# EAGLE design 4 Channel Mixer - Modular (EAGLE 9.6.2)
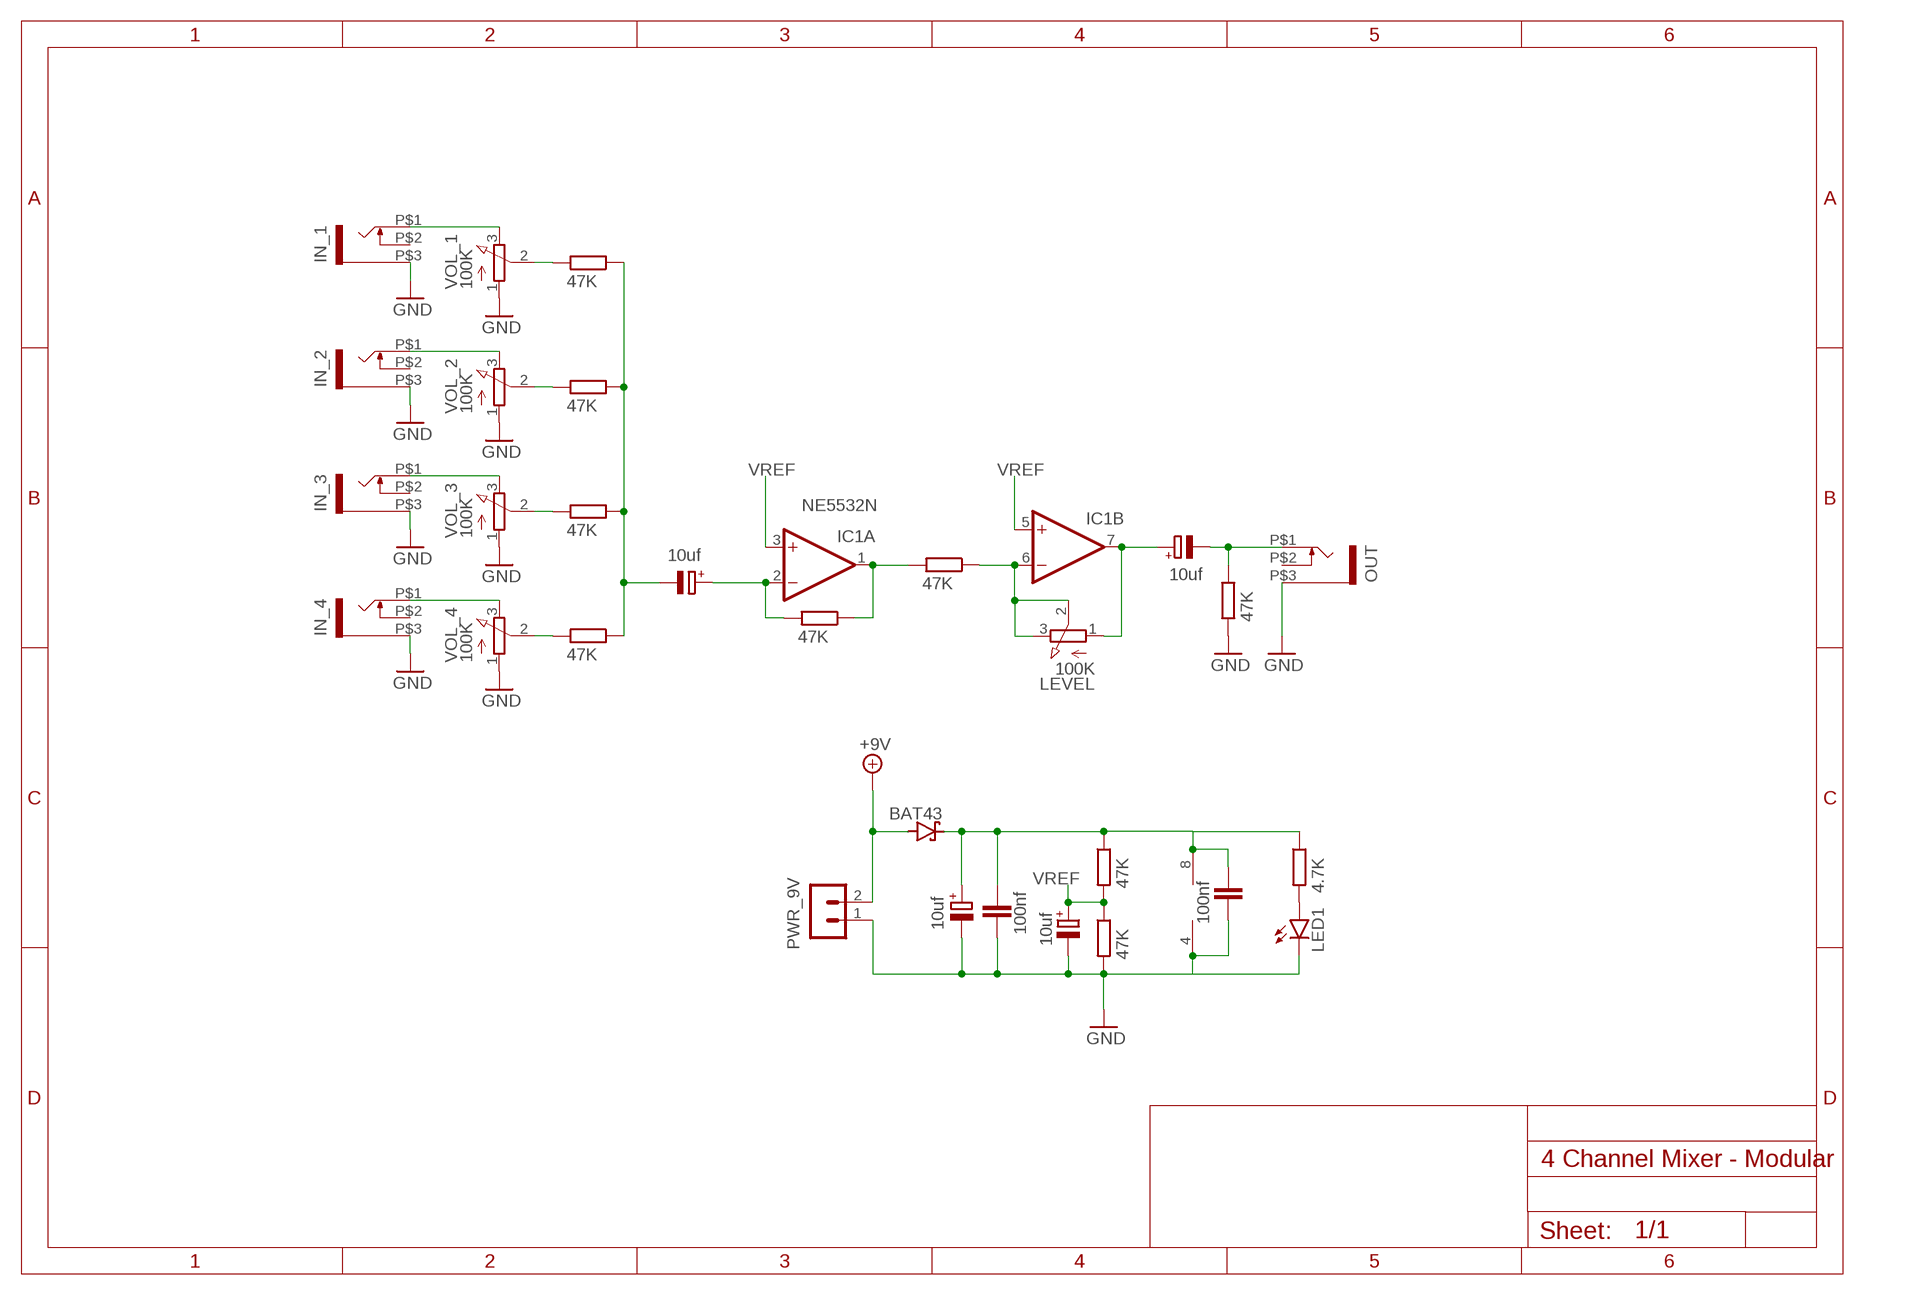
[diagram p0: schematic, sheet 1]

## Parts
C1  10uf  CPOL-EUE2,5-6E  [E2,5-6E]
C2  10uf  CPOL-EUE2,5-6E  [E2,5-6E]
C3  10uf  CPOL-EUE2,5-6E  [E2,5-6E]
C4  10uf  CPOL-EUE2,5-6E  [E2,5-6E]
C5  100nf  C-EU050-024X044  [C050-024X044]
C6  100nf  C-EU050-024X044  [C050-024X044]
D4  BAT43  BAT42  [DO35-10]
IC1  NE5532N  [DIL08]
IN_1  WQP-PJ301M-12_JACK  [WQP-PJ301M-12_JACK]
IN_2  WQP-PJ301M-12_JACK  [WQP-PJ301M-12_JACK]
IN_3  WQP-PJ301M-12_JACK  [WQP-PJ301M-12_JACK]
IN_4  WQP-PJ301M-12_JACK  [WQP-PJ301M-12_JACK]
LED1  LED3MM  [LED3MM]
LEVEL  100K  EVUF2M  [EVUFXM]
OUT  WQP-PJ301M-12_JACK  [WQP-PJ301M-12_JACK]
PWR_9V  B2B-PH-K-S  [B2B-PH-K-S]
R1  47K  R-EU_0204/7  [0204/7]
R2  47K  R-EU_0204/7  [0204/7]
R3  47K  R-EU_0204/7  [0204/7]
R5  47K  R-EU_0204/7  [0204/7]
R7  47K  R-EU_0204/7  [0204/7]
R8  47K  R-EU_0204/7  [0204/7]
R9  47K  R-EU_0204/7  [0204/7]
R10  47K  R-EU_0204/7  [0204/7]
R11  47K  R-EU_0204/7  [0204/7]
R12  4.7K  R-EU_0204/7  [0204/7]
VOL_1  100K  EVUF2M  [EVUFXM]
VOL_2  100K  EVUF2M  [EVUFXM]
VOL_3  100K  EVUF2M  [EVUFXM]
VOL_4  100K  EVUF2M  [EVUFXM]

## Nets
+9V: D4.A PWR_9V.2
GND: C3.- C4.- C5.1 C6.1 IC1.4(P:V-) IN_1.P$3 IN_2.P$3 IN_3.P$3 IN_4.P$3 LED1.K(C) OUT.P$3 PWR_9V.1 R9.2 R11.2 VOL_1.1(A) VOL_2.1(A) VOL_3.1(A) VOL_4.1(A)
N$1: IN_1.P$1 VOL_1.3(E)
N$2: R1.2 VOL_2.2(S)
N$3: IN_2.P$1 VOL_2.3(E)
N$4: R2.2 VOL_3.2(S)
N$5: IN_4.P$1 VOL_4.3(E)
N$6: R3.2 VOL_4.2(S)
N$7: IN_3.P$1 VOL_3.3(E)
N$8: R5.2 VOL_1.2(S)
N$12: C1.- R1.1 R2.1 R3.1 R5.1
N$13: C2.- OUT.P$1 R9.1
N$14: C1.+ IC1.2(A:-IN) R7.2
N$16: IC1.1(A:OUT) R7.1 R8.2
N$17: IC1.6(B:-IN) LEVEL.2(S) LEVEL.3(E) R8.1
N$18: C2.+ IC1.7(B:OUT) LEVEL.1(A)
N$20: LED1.A R12.2
N$21: C4.+ C5.2 C6.2 D4.C IC1.8(P:V+) R10.1 R12.1
VREF: C3.+ IC1.3(A:+IN) IC1.5(B:+IN) R10.2 R11.1
Unconnected: IN_1.P$2 IN_2.P$2 IN_3.P$2 IN_4.P$2 OUT.P$2

## Library data of the parts
C1-C4 = rcl:CPOL-EU: POLARIZED CAPACITOR, European symbol; SPICEPREFIX: C
C5 C6 = rcl:C-EU: CAPACITOR, European symbol; SPICEPREFIX: C
D4 = diode:BAT42: DIODE barrier diode
IC1 = linear4:NE5532: AUDIO AMPLIFIER
IN_1-IN_4 OUT = thonkiconn:WQP-PJ301M-12_JACK
LED1 = led:LED: LED OSRAM: - CHIPLED LG R971, LG N971, LY N971, LG Q971, LY Q971, LO R971, LY R971 LH N974, LH R974 LS Q976, LO Q976, LY Q976 LO Q996 - Hyper CHIPLED LW Q18S LB Q993, LB Q99A, LB R99A - SideLED LS A670, LO A670, LY A670, LG A670, LP A670 LB A673, LV A673, LT A673, LW A673 LH A674 LY A675 LS A676, LA A676, LO A676, LY A676, LW A676 LS A679, LY A679, LG A679 - Hyper Micro SIDELED® LS Y876, LA Y876, LO Y876, LY Y876 LT Y87S - SmartLED LW L88C, LW L88S LB L89C, LB L89S, LG L890 LS L89K, LO L89K, LY L89K LS L896, LA L896, LO L896, LY L896 - TOPLED LS T670, LO T670, LY T670, LG T670, LP T670 LSG T670, LSP T670, LSY T670, LOP T670, LYG T670 LG T671, LOG T671, LSG T671 LB T673, LV T673, LT T673, LW T673 LH T674 LS T676, LA T676, LO T676, LY T676, LB T676, LH T676, LSB T676, LW T676 LB T67C, LV T67C, LT T67C, LS T67K, LO T67K, LY T67K, LW E67C LS E67B, LA E67B, LO E67B, LY E67B, LB E67C, LV E67C, LT E67C LW T67C LS T679, LY T679, LG T679 LS T770, LO T770, LY T770, LG T770, LP T770 LB T773, LV T773, LT T773, LW T773 LH T774 LS E675, LA E675, LY E675, LS T675 LS T776, LA T776, LO T776, LY T776, LB T776 LHGB T686 LT T68C, LB T68C - Hyper Mini TOPLED® LB M676 - Mini TOPLED Santana® LG M470 LS M47K, LO M47K, LY M47K Source: http://www.osram.convergy.de LUXEON: - LUMILED® LXK2-PW12-R00, LXK2-PW12-S00, LXK2-PW14-U00, LXK2-PW14-V00 LXK2-PM12-R00, LXK2-PM12-S00, LXK2-PM14-U00 LXK2-PE12-Q00, LXK2-PE12-R00, LXK2-PE12-S00, LXK2-PE14-T00, LXK2-PE14-U00 LXK2-PB12-K00, LXK2-PB12-L00, LXK2-PB12-M00, LXK2-PB14-N00, LXK2-PB14-P00, LXK2-PB14-Q00 LXK2-PR12-L00, LXK2-PR12-M00, LXK2-PR14-Q00, LXK2-PR14-R00 LXK2-PD12-Q00, LXK2-PD12-R00, LXK2-PD12-S00 LXK2-PH12-R00, LXK2-PH12-S00 LXK2-PL12-P00, LXK2-PL12-Q00, LXK2-PL12-R00 Source: www.luxeon.com KINGBRIGHT: KA-3528ASYC Source: www.kingbright.com
LEVEL VOL_1-VOL_4 = pot:EVU: 9 mm Square Rotary Potentiometers Source: Panasonic
PWR_9V = con-JST PH:B2B-PH: JST PH series header 2.00mm pitch disconnectable crimp style connectors, vertical (side entry type), 2 pins
R1-R3 R5 R7-R12 = rcl:R-EU_: RESISTOR, European symbol; SPICEPREFIX: R

## Board
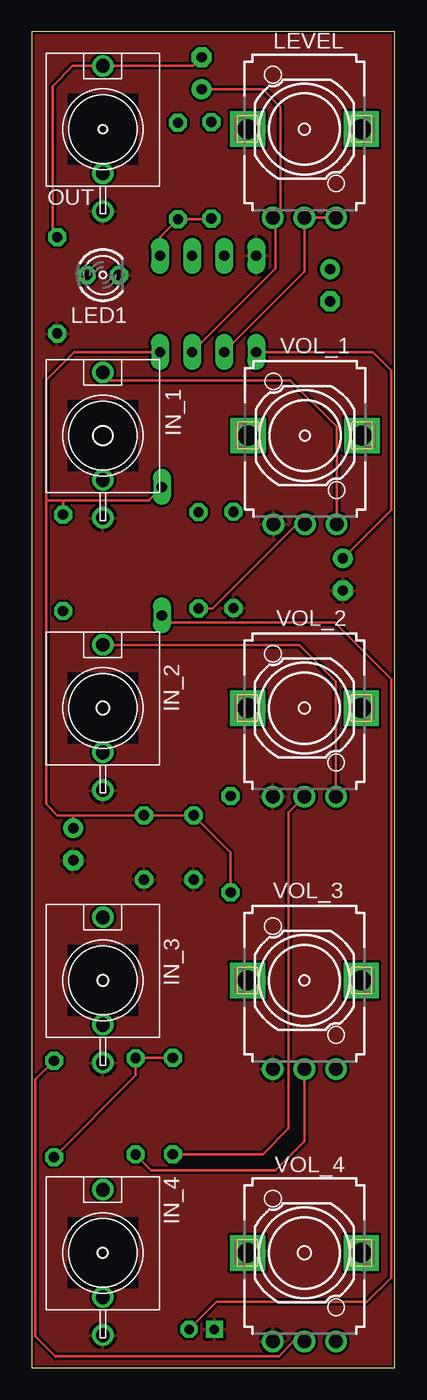
[diagram p1: board, top side]
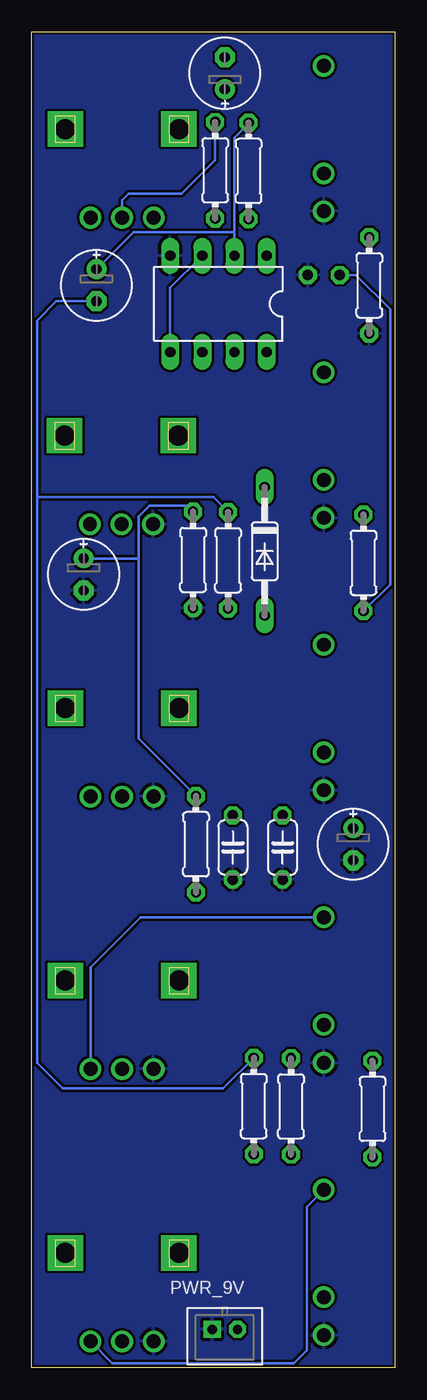
[diagram p2: board, bottom side, seen from below]

Size 28.75 x 105.65 mm. Coordinates in mm from the lower left corner, seen from the top.
Outline: 0,0 28.75,0 28.75,105.65 0,105.65 0,0
Copper layers (1*16): Top 0.035mm / dielectric 1.5mm / Bottom 0.035mm
Design rules "SparkFun": minimum track width 8mil, minimum drill 20mil, track to track 8mil, track to pad 8mil, pad to pad 8mil, via to via 8mil, smd to smd 8mil, copper to edge 8mil, drill to drill 8mil, minimum pad ring 12mil, minimum via ring 10mil, stop-mask expansion 4mil, vias tented up to drill 20mil, thermal gap 10mil

### Footprints (pad centres in the part's own frame; a part is rotated, then mirrored left to right if it is on the bottom)
E2,5-6E = drill 0.813 pad 1.575: + -1.27,0 | drill 0.813 pad 1.575 octagon: - 1.27,0
C050-024X044 = drill 0.813 octagon: 1 -2.54,0; 2 2.54,0
DO35-10 = drill 0.813 long: A 5.08,0; C -5.08,0
DIL08 = drill 0.813 long: 1 -3.81,-3.81; 2 -1.27,-3.81; 3 1.27,-3.81; 4 3.81,-3.81; 5 3.81,3.81; 6 1.27,3.81; 7 -1.27,3.81; 8 -3.81,3.81
WQP-PJ301M-12_JACK = drill 1.1: P$1 0,5; P$2 0,-3.5; P$3 0,-6.5
LED3MM = drill 0.813 octagon: A -1.27,0; K 1.27,0
EVUFXM = drill 1.1 pad 1.676: 1 -2.5,-7; 2 0,-7; 3 2.5,-7 | drill 1.6 pad 2.8 square: M1 4.5,0; M2 -4.5,0
B2B-PH-K-S = drill 0.75 pad 1.3 square: 1 1,0 | drill 0.75 pad 1.3 octagon: 2 -1,0
0204/7 = drill 0.813 octagon: 1 -3.81,0; 2 3.81,0

### Placement (x,y rotation side)
C1  23.62,85.6 270 bottom
C2  13.46,102.36 90 bottom
C3  24.64,62.74 270 bottom
C4  3.3,41.4 270 bottom
C5  8.89,41.15 90 bottom
C6  12.83,41.15 90 bottom
D4  10.31,64.57 270 bottom
IC1  13.97,84.12 180 bottom
IN_1  5.64,73.71 0 top
IN_2  5.64,52.17 0 top
IN_3  5.64,30.63 0 top
IN_4  5.64,9.09 0 top
LED1  5.64,86.41 0 top
LEVEL  21.59,97.94 0 top
OUT  5.64,97.94 0 top
PWR_9V  13.46,3.05 180 bottom
R1  11.18,20.7 270 bottom
R2  8.23,20.68 270 bottom
R3  1.78,20.47 90 bottom
R5  13.21,63.86 270 bottom
R7  11.58,94.64 90 bottom
R8  14.22,94.69 270 bottom
R9  2.03,85.6 270 bottom
R10  15.75,41.4 90 bottom
R11  15.98,63.88 270 bottom
R12  2.49,63.65 270 bottom
VOL_1  21.64,73.71 0 top
VOL_2  21.59,52.17 0 top
VOL_3  21.59,30.63 0 top
VOL_4  21.59,9.09 0 top

### Tracks (layer width: path | path; a pad name or v marks a point on that pad's centre or on a via)
+9V
  Top 0.203: PWR_9V.2 14.62,5.21 26.54,5.21 28.45,7.11 28.45,54.48 24,58.93 10.87,58.93 D4.A
GND
  pour Top: 0,105.66 28.7,105.66 28.7,0 0,0
  pour Bottom: 0,105.66 28.7,105.66 28.7,0 0,0
N$1
  Top 0.203: IN_1.P$1 6.27,78.08 20.48,78.08 24.14,74.41 VOL_1.3
N$2
  Top 0.203: R1.2 18.29,16.89 20.32,18.92 20.32,43.9 VOL_2.2
N$3
  Top 0.203: IN_2.P$1 21.19,57.17 24.09,54.27 VOL_2.3
N$4
  Top 0.203: R2.2 9.47,15.62 19.3,15.62 21.59,17.91 VOL_3.2
N$5
  Bottom 0.203: VOL_4.3 22.38,0.38 8,0.38 6.99,1.4 6.99,12.75 IN_4.P$1
N$6
  Top 0.203: VOL_4.2 20.73,2.09 19.57,0.93 1.95,0.93 1.91,0.89 0.3,2.49 0.3,22.81 R3.2
N$7
  Bottom 0.203: IN_3.P$1 20.12,35.63 24.09,31.66 VOL_3.3
N$8
  Top 0.203: VOL_1.2 20.99,66.71 14.33,60.05 R5.2
N$12
  Top 0.203: R3.1 8.23,23.11 R2.1 8.26,24.51 R1.1
  Bottom 0.203: R1.1 13.59,22.1 26.29,22.1 28.32,24.13 28.32,68.83 | 28.32,68.83 28.32,82.8 26.8,84.33 C1.- | R5.1 14.38,68.83 28.32,68.83
N$13
  Top 0.203: R9.1 1.65,89.79 1.65,101.35 3.25,102.94 OUT.P$1 12.77,102.94 C2.-
N$14
  Bottom 0.203: IC1.2 12.7,89.79 | 12.7,89.79 18.22,89.79 18.23,89.78 19.57,89.78 19.58,89.79 20.7,89.79 C1.+ | 12.7,89.79 12.7,97.28 11.58,98.4 R7.2
N$16
  Top 0.203: IC1.1 10.16,89.41 R7.1 14.17,90.83 R8.2
N$17
  Top 0.203: IC1.6 21.59,86.67 LEVEL.2 LEVEL.3
  Bottom 0.203: R8.1 14.22,95.5 16.89,92.84 21.08,92.84 21.59,92.33 LEVEL.2
N$18
  Top 0.203: IC1.7 19.3,86.92 19.3,90.73 LEVEL.1 19.68,91.54 19.68,99.69 18.29,101.09 C2.+
N$20
  Bottom 0.203: R12.2 0.38,61.95 0.38,83.69 3.1,86.41 LED1.A
N$21
  Top 0.203: C4.+ 3.3,43.69 | 3.3,43.69 C5.2 C6.2 15.75,40.77 R10.1 | IC1.8 3.35,80.31 1.14,78.11 1.14,68.58 | 1.14,68.58 1.14,44.58 2.03,43.69 3.3,43.69 | D4.C 9.25,68.58 2.49,68.58 | 2.49,68.58 R12.1 | 2.49,68.58 1.14,68.58
VREF
  Top 0.203: C3.+ 28.45,67.82 28.45,78.87 27,80.31 IC1.5
  Bottom 0.203: 20.3,64.01 20.3,49.76 R10.2 | 20.3,64.01 20.3,67.33 19.43,68.2 16.48,68.2 R11.1 | C3.+ 20.3,64.01 | IC1.3 17.78,85.39 IC1.5